# Altium schematic sheet Power.SchDoc
size A4; SheetNumber: 4; SheetTotal: 4
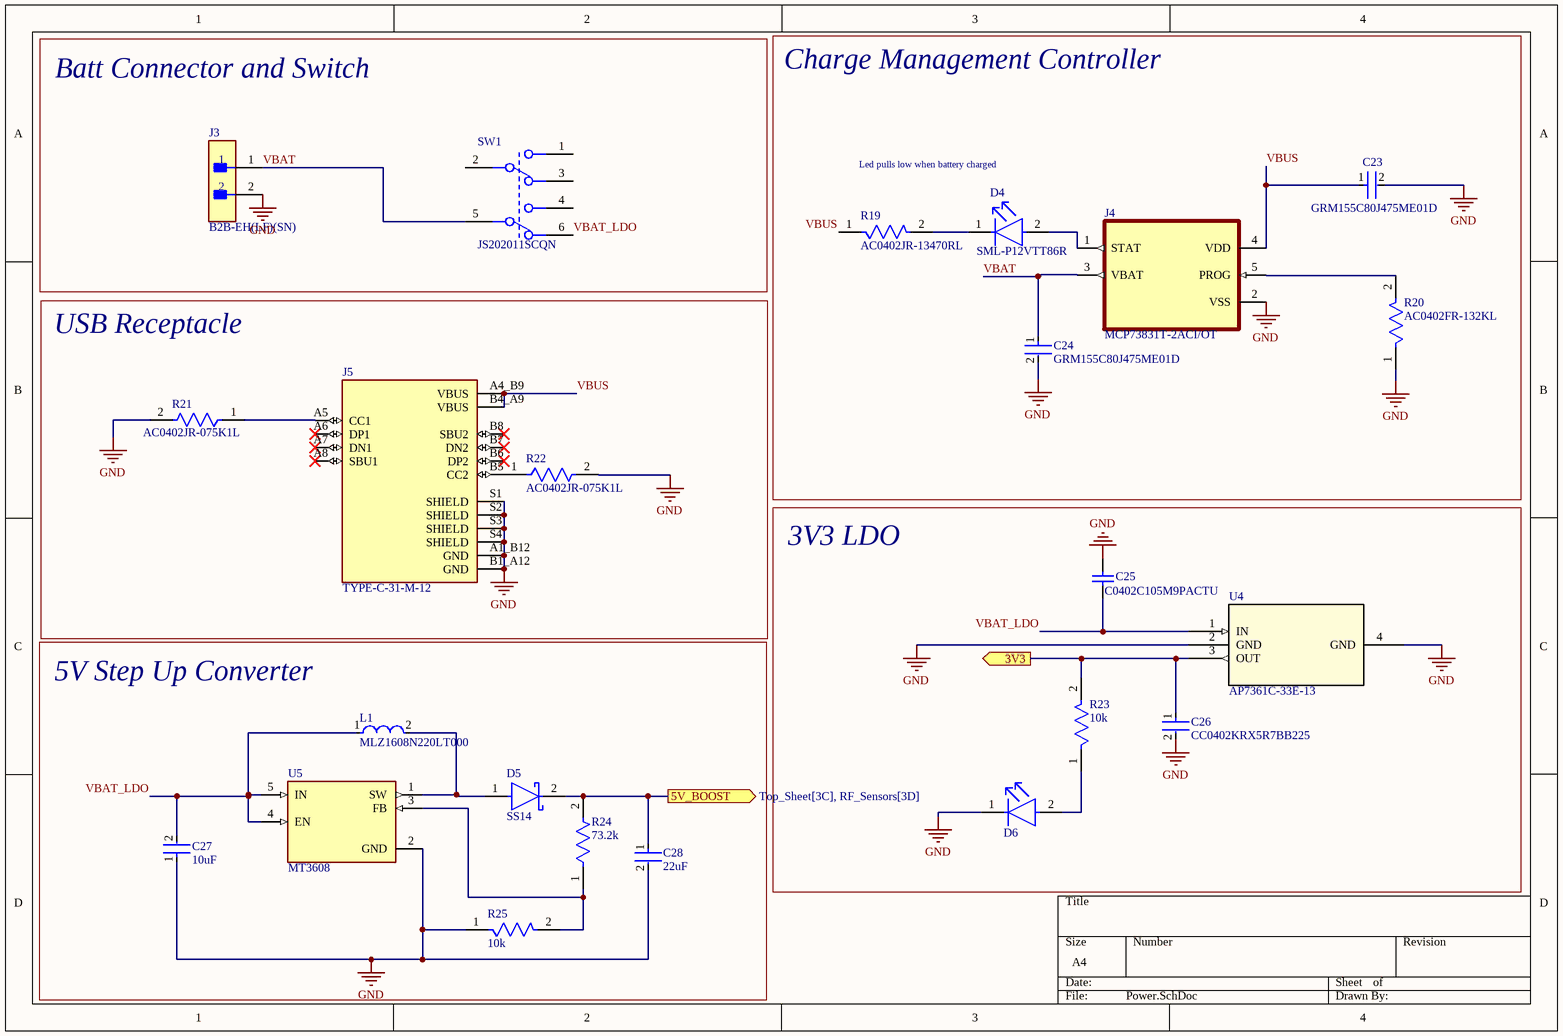
[diagram p0: Power.SchDoc]

## Parts
C23  GRM155C80J475ME01D  [FP-GRM155-0_2-MFG]
C24  GRM155C80J475ME01D  [FP-GRM155-0_2-MFG]
C25  C0402C105M9PACTU  [CAPC1005X60X30ML05T10]
C26  CC0402KRX5R7BB225  [FP-CC0402-CC-MFG]
C27  10uF  [FP-C0402C106M9PACTU-MFG]
C28  22uF  [FP-GRM158-0_2-MFG]
D4  SML-P12VTT86R  [FP-SML-P1-MFG]
D5  SS14  [FP-403AE-MFG]
D6  SML-P12VTT86R  [FP-SML-P1-MFG]  (value not drawn)
J3  B2B-EH(LF)(SN)  [FP-B2B-EH_LF_SN-MFG]
J4  MCP73831T-2ACI/OT  [SOT95P280X145-5N]
J5  TYPE-C-31-M-12  [HRO_TYPE-C-31-M-12]
L1  MLZ1608N220LT000  [FP-MLZ1608-IPC_A]
R19  AC0402JR-13470RL  [FP-AC0402-MFG]
R20  AC0402FR-132KL  [FP-AC0402-IPC_A]
R21  AC0402JR-075K1L  [FP-AC0402-IPC_C]
R22  AC0402JR-075K1L  [FP-AC0402-IPC_C]
R23  10k  [FP-AC0402-MFG]
R24  73.2k  [FP-AF0402-IPC_C]
R25  10k  [FP-AC0402-MFG]
SW1  JS202011SCQN  [FP-JS202011SCQN-MFG]
U4  AP7361C-33E-13  [SOT223_DIO]
U5  MT3608  [SOT95P280X145-6N]

## Blocks framed on the sheet
Batt Connector and Switch: J3 SW1
Charge Management Controller: C23 C24 D4 J4 R19 R20
USB Receptacle: J5 R21 R22
3V3 LDO: C25 C26 D6 R23 U4
5V Step Up Converter: C27 C28 D5 L1 R24 R25 U5

## Ports
3V3 (out, see Top_Sheet[3C], MCU,SD,FLASH[3C], MCU,SD,FLASH[4A], MCU,SD,FLASH[4B], MCU,SD,FLASH[5A], MCU,SD,FLASH[5C], MCU,SD,FLASH[6B], MCU,SD,FLASH[6C], MCU,SD,FLASH[7A], RF_Sensors[1C], RF_Sensors[1D], RF_Sensors[2A], RF_Sensors[3A], RF_Sensors[3D]), 5V_BOOST (out, see Top_Sheet[3C], RF_Sensors[3D])

## Nets
GND: C23.2 C24.2 C25.2 C26.2 C27.1 C28.2 D6.1(C) J3.2 J4.2(VSS) J5.A1_B12(GND) J5.B1_A12(GND) J5.S1(SHIELD) J5.S2(SHIELD) J5.S3(SHIELD) J5.S4(SHIELD) R20.1 R21.2 R22.2 R25.1 U4.2(GND) U4.4(GND) U5.2(GND)
3V3: C26.1 R23.2 U4.3(OUT) ; port 3V3
5V_BOOST: C28.1 D5.2(C) R24.2 ; port 5V_BOOST
VBAT: C24.1 J3.1 J4.3(VBAT) SW1.5
VBAT_LDO: C25.1 C27.2 L1.1 SW1.6 U4.1(IN) U5.4(EN) U5.5(IN)
VBUS: C23.1 J4.4(VDD) J5.A4_B9(VBUS) J5.B4_A9(VBUS) R19.1
NetD4_1: D4.1(C) R19.2
NetD4_2: D4.2(A) J4.1(STAT)
NetD5_1: D5.1(A) L1.2 U5.1(SW)
NetD6_2: D6.2(A) R23.1
NetJ4_5: J4.5(PROG) R20.2
NetJ5_A5: J5.A5(CC1) R21.1
NetJ5_B5: J5.B5(CC2) R22.1
NetR24_1: R24.1 R25.2 U5.3(FB)

Not connected (* = marked no-connect by the designer): J5 A6(DP1)* A7(DN1)* A8(SBU1)* B6(DP2)* B7(DN2)* B8(SBU2)*; SW1 1 2 3 4

## Notes on the sheet
- Led pulls low when battery charged

## Library data of the parts
C23 C24 = CMP-00260-151029462-1: Voltage Rating (DC): 6.3V; Capacitance: 4.7µF; Dielectric: X6S; Length: 1mm; Case/Package: 0402; Width: 500µm; NexarPartId: 151029462; Thickness: 500µm
C25 = CMP-2008-02052-1: Manufacturer: Kemet; Part Number: C0402C105M9PACTU
C26 = CMP-03422-000732-3: CAP CER 2.2UF 16V X5R 0402; Tolerance: 10%; Case Code (Imperial): 0402; Width: 0.5mm; Max Operating Temperature: 85°C; Length: 0.039inch; Thickness: 0.022inch; Termination: SMD/SMT; Halogen Free: Halogen Free; Voltage Rating (DC): 16V; Packaging: Tape and Reel; RoHS Compliant: Yes; Lead Free: Lead Free; Weight: 2.3E-05oz; Package Quantity: 5000; Height: 0.5mm; Case Code (Metric): 1005; Dielectric: X5R; Case/Package: 0402; Capacitance: 2.2uF; Mount: Surface Mount; Voltage Rating: 16V; Min Operating Temperature: -55°C
C27 = CMP-03020-034678-1: CAP CER 10UF 6.3V X5R 0402; Tolerance: 20%; Dielectric Material: Ceramic; Voltage Rating: 6.3V; Thickness: 0.028inch; REACH SVHC: No SVHC; RoHS Compliant: Yes; Case Code (Metric): 1005; Lead Free: Lead Free; Length: 0.039inch; Max Operating Temperature: 85°C; Capacitance: 10uF; Voltage Rating (DC): 6.3V; Min Operating Temperature: -55°C; Case/Package: 0402; Mount: Surface Mount; Case Code (Imperial): 0402; Dielectric: X5R; Packaging: Cut Tape; Width: 0.02inch
C28 = CMP-06035-020400-1: Chip Multilayer Ceramic Capacitors for General Purpose, 0402, 22uF, X5R, 15%, 20%, 10V
D4 D6 = CMP-08952-000002-1: LED RED CLEAR 0402 SMD; Manufacturer: Rohm; Wavelength: 630nm; Luminous Intensity: 60mcd; Led Orientation: Top View; Forward Current: 20mA; Reverse Voltage: 5V; Power Dissipation: 50mW; Forward Voltage: 2V; Mouser Description: SML-P1 Series Red 0402 Clear 60 mcd 2V Surface Mount PICOLED? LED; Package: SML-P1; Colour: Red; Temperature Range Low: -40°C; Octopart: https://octopart.com/sml-p12vtt86r-rohm-34112315; Automotive: No; Temperature: -40°C to +85°C; Digikey Description: LED RED CLEAR 0402 SMD; ComponentLink2URL: https://www.rohm.com/datasheet/SML-P12VT(R)/sml-p1-e; Device Class L1: Optoelectronics; Device Class L3: unset; Category: Diode; Temperature Range High: +85°C; ComponentLink2Description: Datasheet; Lead Free: Yes; Manufacturer Part Number: SML-P12VTT86R; RoHS: TRUE; Device Class L2: LEDs; Height: 0.25mm
D5 = CMP-2000-04943-2: DIODE SCHOTTKY 40V 1A SMA; Manufacturer: ON Semiconductor; Peak Reverse Current: 0.2mA; Max Junction Temp: +125°C; Standoff Height: 0.05mm; Max Surge Forward Current: 40A; Mouser Description: Schottky Diodes & Rectifiers SMA 40V 1.0A; RoHS: TRUE; Lead Free: Yes; Manufacturer Part Number: SS14; Device Class L3: Schottky Diodes; Category: Diode; Automotive: No; Digikey Description: DIODE SCHOTTKY 40V 1A SMA; ComponentLink2Description: Datasheet; Device Class L2: Diodes; Height: 2.5mm; Temperature Range High: +125°C; ComponentLink2URL: https://www.onsemi.com/pub/Collateral/SS19-D.PDF; Device Class L1: Discrete Semiconductors; Package: 403AE; Octopart: https://octopart.com/ss14-on+semiconductor-29205033; Max Repetitive Reverse Voltage: 40V; Temperature Range Low: -65°C; Forward Current: 1A; Temperature: -65°C to +125°C
J3 = CMP-17439-000683-1: Connector Header, EH Series, 2 Position, 2.5mm, Through Hole, Press-Fit, Solder, Natural; Voltage Rating: 250V; Current Rating: 3A; Number of Positions: 2; Lead Free: Lead Free; Series: EH; Orientation: Straight; Pitch: 2.5mm; Termination: Solder; Mount: Through Hole; Number of Rows: 1; Contact Material: Brass; Number of Contacts: 2
J4 = MCP73831T-2ACI/OT: Charger IC Lithium Ion/Polymer SOT-23-5; MF: Microchip; Package: SOT-23 Microchip; Purchase-URL: https://pricing.snapeda.com/search/part/MCP73831T-2ACI/OT/?ref=eda; MP: MCP73831T-2ACI/OT; Value: *; Availability: In Stock; SnapEDA_Link: https://www.snapeda.com/parts/MCP73831T-2ACI/OT/Microchip/view-part/?ref=snap; Price: None; Check_prices: https://www.snapeda.com/parts/MCP73831T-2ACI/OT/Microchip/view-part/?ref=eda
J5 = TYPE-C-31-M-12: USB Connectors 24 Receptacle 1 8.94*7.3mm RoHS; MF: HRO Electronics Co., Ltd.; SnapEDA_Link: https://www.snapeda.com/parts/TYPE-C-31-M-12/HRO+Electronics+Co.%252C+Ltd./view-part/?ref=snap; Package: Package; Value: *; MP: TYPE-C-31-M-12; Check_prices: https://www.snapeda.com/parts/TYPE-C-31-M-12/HRO+Electronics+Co.%252C+Ltd./view-part/?ref=eda
L1 = CMP-08253-000063-1: Shielded Multilayer Inductor 22uH ±20% 190mA 2145mΩ SMD 0603; Core Material: Ferrite; Test Frequency: 2MHz; Current Rating: 300mA; DC Resistance (DCR): 2.145R; Saturation Current: 50mA; Height: 0.8mm; Inductance: 22uH; Width: 0.031inch; Packaging: Tape and Reel; Tolerance: 20%; Height - Seated (Max): 0.037inch; Case Code (Imperial): 0603; Shielding: Shielded; Weight: 0.000141oz; Case/Package: 0603; Lead Free: Lead Free; Package Quantity: 4000; Termination: SMD/SMT; Min Operating Temperature: -55°C; Length: 0.063inch; Mount: Surface Mount; Max Operating Temperature: 125°C; Case Code (Metric): 1608; RoHS Compliant: Yes
R19 R23 R25 = CMP-03412-049712-1: RES 470Ω ±5% 0.063W 0402
R20 = CMP-03412-047704-1: RES 2kΩ ±1% 0.063W 0402
R21 R22 = CMP-03412-038544-1: RES 5.1kΩ ±5% 0.063W 0402; Temperature Coefficient: 100ppm/°C; Voltage Rating: 50V; Resistance: 5.1kR; Power Rating: 62.5mW; Max Power Dissipation: 63mW; Tolerance: 5%; Features: Moisture Resistant; Packaging: Tape and Reel; Case Code (Imperial): 0402; Min Operating Temperature: -55°C; Series: AC; Length: 0.039inch; Number of Terminations: 2; Weight: 2.3E-05oz; Width: 0.5mm; Case/Package: 0402; RoHS Compliant: Yes; Max Operating Temperature: 155°C; Termination: SMD/SMT; Case Code (Metric): 1005; Height: 0.015inch; Resistor Type: Thick Film
R24 = CMP-03412-048471-1: Anti-Sulfurated Chip Resistors Automotive Grade 73.2kΩ 1% 100ppm/°C 0402; Resistance: 73.2kR; Max Power Dissipation: 63mW; Packaging: Tape and Reel; Series: AF; Features: Moisture Resistant; Height: 0.015inch; Length: 0.039inch; Tolerance: 1%; Case/Package: 0402; Width: 0.02inch; Min Operating Temperature: -55°C; Max Operating Temperature: 155°C; Number of Terminations: 2; Resistor Type: Thick Film; RoHS Compliant: Yes; Temperature Coefficient: 100ppm/°C
SW1 = CMP-2000-05087-3: SWITCH SLIDE DPDT 300MA 6V; Switch Function: On-On; Actuator Type: Standard; Switch Travel: 2mm; Actuator Color: Black; Contact Resistance: 70mR; Electrical Life: 5000Cycles; Actuator Material: Nylon; REACH SVHC: No SVHC; Series: JS; Min Operating Temperature: -20°C; Depth: 7.5mm; Housing Material: Nylon; Voltage Rating (DC): 6V; Max Operating Temperature: 85°C; Contact Current Rating: 300mA; Package Quantity: 1; Contact Plating: Silver; Contact Material: Copper Alloy; Throw Configuration: DPDT; Current Rating: 300mA; Orientation: Vertical; Max Current Rating: 300mA; Max Voltage Rating (DC): 6V; Flammability Rating: UL94 V-2; Length: 9mm; Packaging: Tape and Reel; Mount: Surface Mount; Actuator Length: 2mm; Lead Free: Lead Free; Termination: Gull Wing; Radiation Hardening: No
U4 = AP7361C-33E-13: Description; Manufacturer_Name: Diodes Inc; Copyright: Copyright (C) 2025 Ultra Librarian. All rights reserved.; Manufacturer_Part_Number: AP7361C-33E-13; RefDes: RefDes; Type: Type
U5 = MT3608: High Efficiency 1.2MHz2A Step Up Converter; MF: Aerosemi Technology Co., Ltd; Price: None; Availability: Not in stock; Package: Package; MP: MT3608; Value: *; SnapEDA_Link: https://www.snapeda.com/parts/MT3608/Aerosemi+Technology+Co.%252C+Ltd/view-part/?ref=snap; Check_prices: https://www.snapeda.com/parts/MT3608/Aerosemi+Technology+Co.%252C+Ltd/view-part/?ref=eda